# Altium project 2_Smoke_detector.PrjPcb (part 1 of 6)
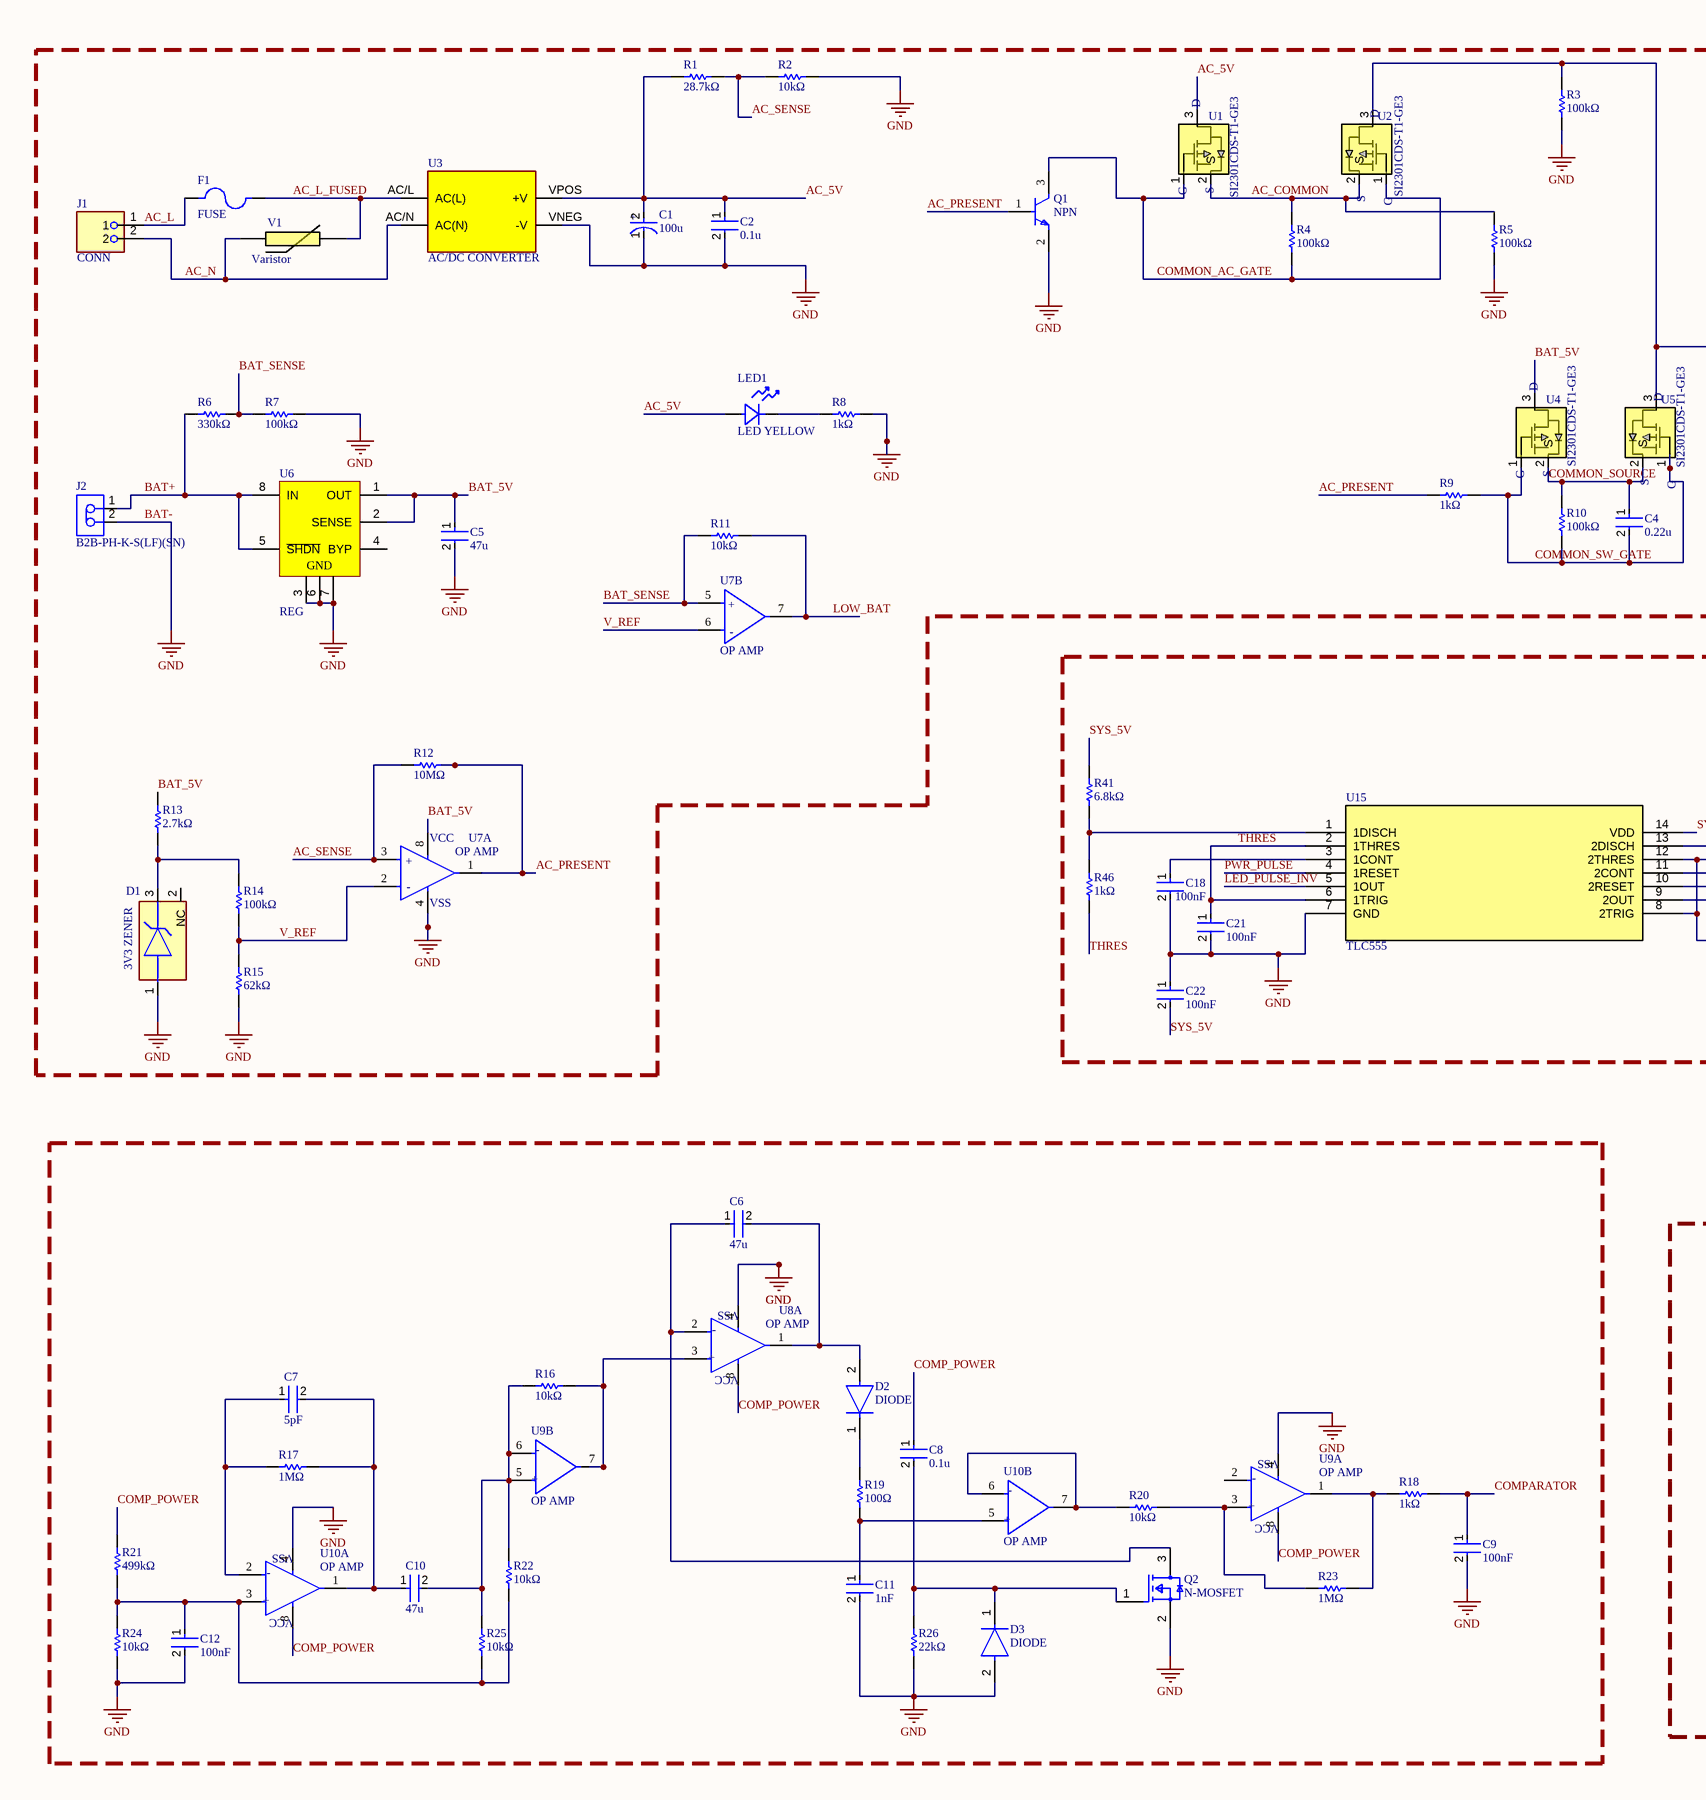
[diagram p0: 2_Smoke_detector.SchDoc, left]
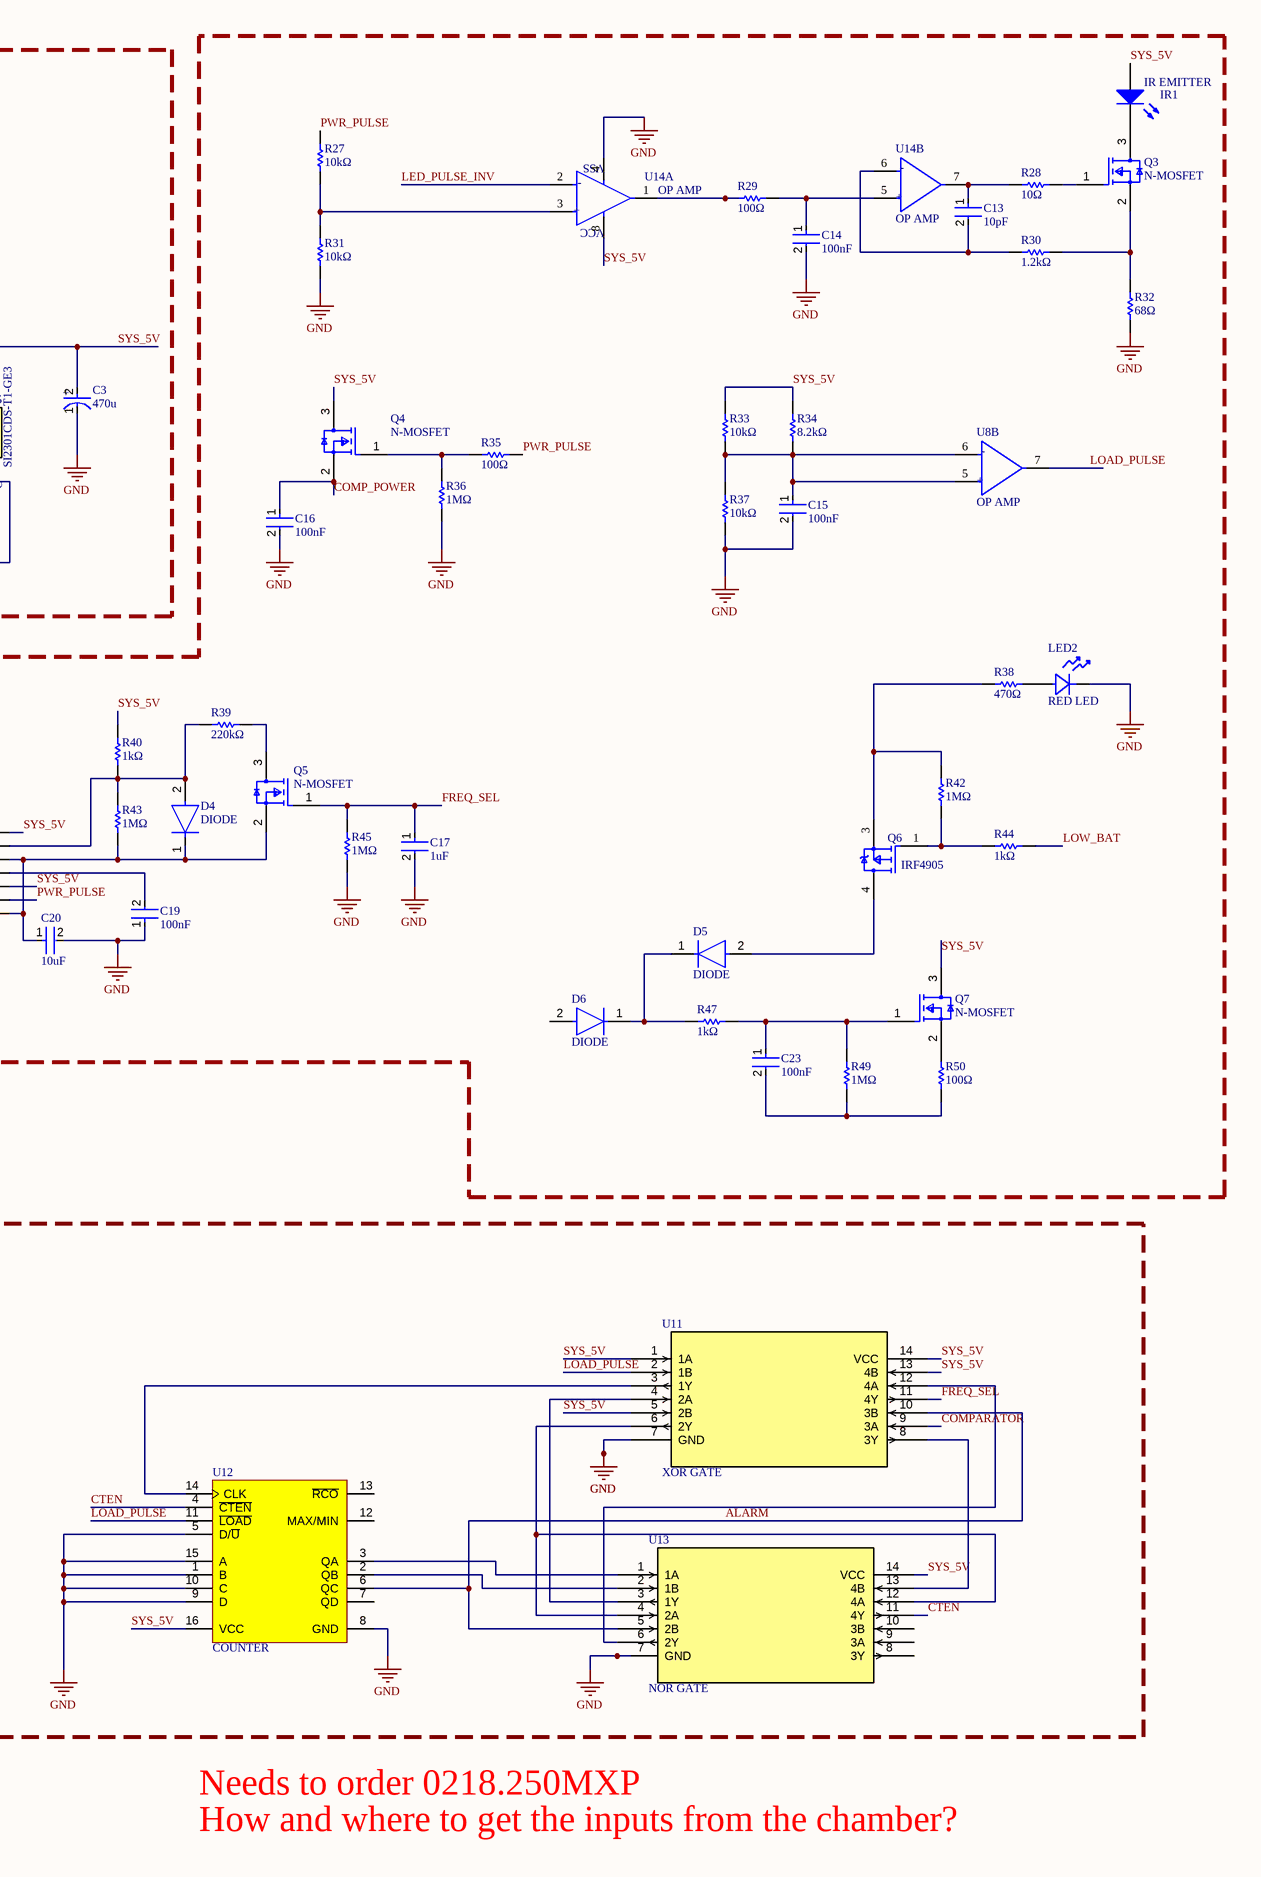
[diagram p1: 2_Smoke_detector.SchDoc, right]
1 sheet, 107 parts. Net scope: global (net labels, ports and power ports of the same name join across sheets).
Board file: 2_Smoke_detector.PcbDoc

## Sheet 2_Smoke_detector.SchDoc
size 558 x 381 mm; SheetNumber: 1; SheetTotal: 1

### Parts
C1  100u  [CAP_100u]
C2  0.1u  [0805_CER_CAP]
C3  470u  [Radial_SMD_CAP]
C4  0.22u  [0805_CER_CAP]
C5  47u  [0805_CER_CAP]
C6  47u  [0805_CER_CAP]
C7  5pF  [0805_CER_CAP]
C8  0.1u  [0805_CER_CAP]
C9  100nF  [0805_CER_CAP]
C10  47u  [0805_CER_CAP]
C11  1nF  [0805_CER_CAP]
C12  100nF  [0805_CER_CAP]
C13  10pF  [0805_CER_CAP]
C14  100nF  [0805_CER_CAP]
C15  100nF  [0805_CER_CAP]
C16  100nF  [0805_CER_CAP]
C17  1uF  [0805_CER_CAP]
C18  100nF  [0805_CER_CAP]
C19  100nF  [0805_CER_CAP]
C20  10uF  [0805_CER_CAP]
C21  100nF  [0805_CER_CAP]
C22  100nF  [0805_CER_CAP]
C23  100nF  [0805_CER_CAP]
D1  3V3 ZENER  [FP-SOT23-IPC_B_ZENER]
D2  DIODE  [FP-477AB-IPC_B]
D3  DIODE  [FP-477AB-IPC_B]
D4  DIODE  [FP-477AB-IPC_B]
D5  DIODE  [FP-477AB-IPC_B]
D6  DIODE  [FP-477AB-IPC_B]
F1  FUSE  [FUSE_4628]
IR1  IR EMITTER  [VISH-TSAL6200]
J1  CONN  [CONN_1715721_PXC]
J2  B2B-PH-K-S(LF)(SN)  [JST]
LED1  LED YELLOW  [LED_XL-2012SURC_XLG]
LED2  RED LED  [LED_XL-2012SURC_XLG-L]
Q1  NPN  [FP-SOT323-IPC_B]
Q2  N-MOSFET  [SOT23_TOS]
Q3  N-MOSFET  [SOT23_TOS]
Q4  N-MOSFET  [SOT23_TOS]
Q5  N-MOSFET  [SOT23_TOS]
Q6  IRF4905  [FP-PG-TO263-3-MFG]
Q7  N-MOSFET  [SOT23_TOS]
R1  28.7kΩ  [0805_RES]
R2  10kΩ  [0805_RES]
R3  100kΩ  [0805_RES]
R4  100kΩ  [0805_RES]
R5  100kΩ  [0805_RES]
R6  330kΩ  [0805_RES]
R7  100kΩ  [0805_RES]
R8  1kΩ  [0805_RES]
R9  1kΩ  [0805_RES]
R10  100kΩ  [0805_RES]
R11  10kΩ  [0805_RES]
R12  10MΩ  [0805_RES]
R13  2.7kΩ  [0805_RES]
R14  100kΩ  [0805_RES]
R15  62kΩ  [0805_RES]
R16  10kΩ  [0805_RES]
R17  1MΩ  [0805_RES]
R18  1kΩ  [0805_RES]
R19  100Ω  [0805_RES]
R20  10kΩ  [0805_RES]
R21  499kΩ  [0805_RES]
R22  10kΩ  [0805_RES]
R23  1MΩ  [0805_RES]
R24  10kΩ  [0805_RES]
R25  10kΩ  [0805_RES]
R26  22kΩ  [0805_RES]
R27  10kΩ  [0805_RES]
R28  10Ω  [0805_RES]
R29  100Ω  [0805_RES]
R30  1.2kΩ  [0805_RES]
R31  10kΩ  [0805_RES]
R32  68Ω  [0805_RES]
R33  10kΩ  [0805_RES]
R34  8.2kΩ  [0805_RES]
R35  100Ω  [0805_RES]
R36  1MΩ  [0805_RES]
R37  10kΩ  [0805_RES]
R38  470Ω  [0805_RES]
R39  220kΩ  [0805_RES]
R40  1kΩ  [0805_RES]
R41  6.8kΩ  [0805_RES]
R42  1MΩ  [0805_RES]
R43  1MΩ  [0805_RES]
R44  1kΩ  [0805_RES]
R45  1MΩ  [0805_RES]
R46  1kΩ  [0805_RES]
R47  1kΩ  [0805_RES]
R49  1MΩ  [0805_RES]
R50  100Ω  [0805_RES]
U1  SI2301CDS-T1-GE3  [TO-236_VIS]
U2  SI2301CDS-T1-GE3  [TO-236_VIS]
U3  AC/DC CONVERTER  [CONV_IRM-05-5]
U4  SI2301CDS-T1-GE3  [TO-236_VIS]
U5  SI2301CDS-T1-GE3  [TO-236_VIS]
U6  REG  [SO-8_S_LIT]
U7  OP AMP  [IC_TLV9062_8_SOIC]  (parts A,B of 2)
U8  OP AMP  [IC_TLV9062_8_SOIC]  (parts A,B of 2)
U9  OP AMP  [IC_TLV9062_8_SOIC]  (parts A,B of 2)
U10  OP AMP  [IC_TLV9062_8_SOIC]  (parts A,B of 2)
U11  XOR GATE  [SOT108-1_NXP]
U12  COUNTER  [D0016A_N]
U13  NOR GATE  [SOT108-1_NXP]
U14  OP AMP  [IC_TLV9062_8_SOIC]  (parts A,B of 2)
U15  TLC555  [D14]
V1  Varistor  [LA_14MM_LOW_LTF]

### Blocks framed on the sheet
BAT-: C1-C5 D1 F1 J1 J2 LED1 Q1 R1-R15 U1-U7 V1

### Nets
GND: C1.1(C) C2.2 C3.1(C) C5.2 C9.2 C11.2 C12.2 C14.2 C15.2 C16.2 C17.2 C18.2 C19.1 C20.2 C21.2 C22.1 D1.1(A) D3.2(A) J2.2 LED2.1 Q1.2(E) Q2.2(S) R2.2 R3.1 R5.1 R7.2 R8.2 R15.1 R24.1 R26.1 R31.1 R32.1 R36.1 R37.1 R45.1 U3.VNEG(-V) U6.3(GND) U6.6(GND) U6.7(GND) U7.4(V-) U8.4(V-) U9.4(V-) U10.4(V-) U11.7(GND) U12.1(B) U12.5(D/~{U}) U12.8(GND) U12.9(D) U12.10(C) U12.15(A) U13.7(GND) U14.4(V-) U15.7(GND)
AC_5V: C1.2(A) C2.1 LED1.2 R1.1 U1.3(D) U3.VPOS(+V)
AC_COMMON: R4.2 R5.2 U1.2(S) U2.2(S)
AC_L: F1.1 J1.1
AC_L_FUSED: F1.2 U3.AC/L(AC(L)) V1.2
AC_N: J1.2 U3.AC/N(AC(N)) V1.1
AC_PRESENT: Q1.1(B) R9.1 R12.2 U7.1(OUT1)
AC_SENSE: R1.2 R2.1 R12.1 U7.3(IN1+)
ALARM: U11.10(3B) U12.6(QC) U13.5(2B)
BAT+: J2.1 R6.1 U6.5(~{SHDN}) U6.8(IN)
BAT_5V: C5.1 R13.2 U4.3(D) U6.1(OUT) U6.2(SENSE) U7.8(V+)
BAT_SENSE: R6.2 R7.1 R11.1 U7.5(IN2+)
COMMON_AC_GATE: Q1.3(C) R4.1 U1.1(G) U2.1(G)
COMMON_SOURCE: C4.1 R10.2 U4.2(S) U5.2(S)
COMMON_SW_GATE: C4.2 R9.2 R10.1 U4.1(G) U5.1(G)
COMP_POWER: C8.1 C16.1 Q4.2(S) R21.2 U8.8(V+) U9.8(V+) U10.8(V+)
COMPARATOR: C9.1 R18.2 U11.9(3A)
CTEN: U12.4(~{CTEN}) U13.11(4Y)
FREQ_SEL: C17.1 Q5.1(G) R45.2 U11.11(4Y)
LED_PULSE_INV: U14.2(IN1-) U15.5(1OUT)
LOAD_PULSE: U8.7(OUT2) U11.2(1B) U12.11(~{LOAD})
LOW_BAT: R11.2 R44.2 U7.7(OUT2)
PWR_PULSE: R27.2 R35.2 U15.4(1RESET) U15.9(2OUT)
SYS_5V: C3.2(A) C22.2 IR1.1(A) Q4.3(D) Q7.3(D) R3.2 R33.2 R34.2 R40.2 R41.1 U2.3(D) U5.3(D) U11.1(1A) U11.5(2B) U11.13(4B) U11.14(VCC) U12.16(VCC) U13.14(VCC) U14.8(V+) U15.10(2RESET) U15.14(VDD)
THRES: C21.1 R46.1 U15.2(1THRES) U15.6(1TRIG)
V_REF: R14.1 R15.2 U7.2(IN1-) U7.6(IN2-)
NetC6_1: C6.1 Q2.3(D) U8.2(IN1-)
NetC6_2: C6.2 D2.2(A) U8.1(OUT1)
NetC7_1: C7.1 R17.1 U10.2(IN1-)
NetC7_2: C7.2 C10.1 R17.2 U10.1(OUT1)
NetC8_2: C8.2 D3.1(C) Q2.1(G) R26.2
NetC10_2: C10.2 R16.2 R22.2 R25.2 U9.5(IN2+) U9.6(IN2-)
NetC11_1: C11.1 R19.1 U10.5(IN2+)
NetC12_1: C12.1 R21.1 R22.1 R24.2 R25.1 U10.3(IN1+)
NetC13_1: C13.1 R28.1 U14.7(OUT2)
NetC13_2: C13.2 R30.1 U14.6(IN2-)
NetC14_1: C14.1 R29.2 U14.5(IN2+)
NetC15_1: C15.1 R33.1 R34.1 R37.2 U8.5(IN2+) U8.6(IN2-)
NetC18_1: C18.1 U15.3(1CONT)
NetC19_2: C19.2 U15.11(2CONT)
NetC20_1: C20.1 D4.1(C) Q5.2(S) R43.1 U15.8(2TRIG) U15.12(2THRES)
NetC23_1: C23.1 Q7.1(G) R47.2 R49.2
NetC23_2: C23.2 R49.1 R50.1
NetD1_3: D1.3(K) R13.1 R14.2
NetD2_1: D2.1(C) R19.2
NetD4_2: D4.2(A) R39.1 R40.1 R43.2 U15.13(2DISCH)
NetD5_1: D5.1(C) D6.1(C) R47.1
NetD5_2: D5.2(A) Q6.4(D)
NetIR1_2: IR1.2(K) Q3.3(D)
NetLED1_1: LED1.1 R8.1
NetLED2_2: LED2.2 R38.2
NetQ3_1: Q3.1(G) R28.2
NetQ3_2: Q3.2(S) R30.2 R32.2
NetQ4_1: Q4.1(G) R35.1 R36.2
NetQ5_3: Q5.3(D) R39.2
NetQ6_1: Q6.1(G) R42.1 R44.1
NetQ6_3: Q6.3(S) R38.1 R42.2
NetQ7_2: Q7.2(S) R50.2
NetR16_1: R16.1 U8.3(IN1+) U9.7(OUT2)
NetR18_1: R18.1 R23.2 U9.1(OUT1)
NetR20_1: R20.1 U10.6(IN2-) U10.7(OUT2)
NetR20_2: R20.2 R23.1 U9.3(IN1+)
NetR27_1: R27.1 R31.2 U14.3(IN1+)
NetR29_1: R29.1 U14.1(OUT1)
NetR41_2: R41.2 R46.2 U15.1(1DISCH)
NetU11_3: U11.3(1Y) U12.14(CLK)
NetU11_4: U11.4(2A) U13.3(1Y)
NetU11_6: U11.6(2Y) U13.4(2A) U13.12(4A)
NetU11_8: U11.8(3Y) U13.13(4B)
NetU11_12: U11.12(4A) U13.6(2Y)
NetU12_2: U12.2(QB) U13.2(1B)
NetU12_3: U12.3(QA) U13.1(1A)

Not connected (* = marked no-connect by the designer): D1 2(NC); D6 2(A); U6 4(BYP); U9 2(IN1-); U12 7(QD) 12(MAX/MIN) 13(~{RCO}); U13 8(3Y) 9(3A) 10(3B)

### Notes on the sheet
- Needs to order 0218.250MXP
- How and where to get the inputs from the chamber?
- (in symbol EEEFK1A471P) +
- (in symbol EEEFT1C101AR) +
- (in symbol TLV9062IDR, part A) VCC; +; -; VSS
- (in symbol TLV9062IDR, part B) +; -